# Altium project CanTho.PrjPCB
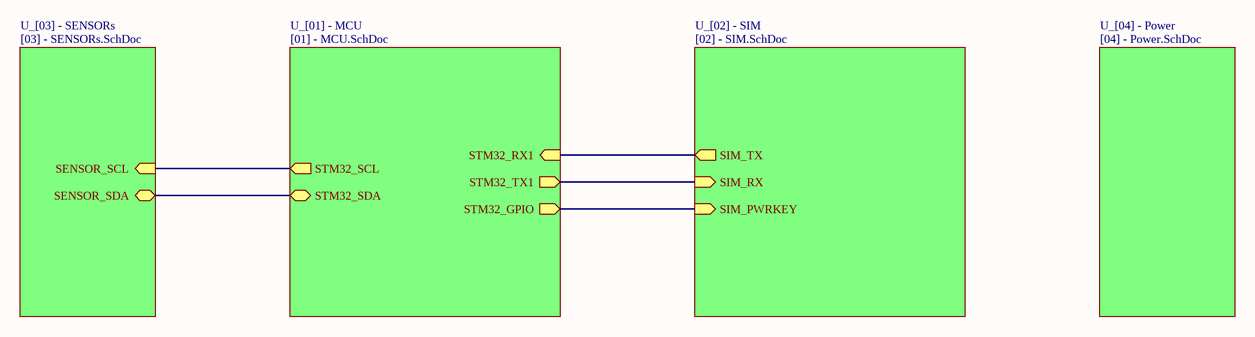
[diagram p0: Sheet_Connector.SchDoc]
5 sheets, 60 parts. Net scope: hierarchical (ports join the sheet entries above them; power ports are global).
Board file: CanTho.PcbDoc
Sheets:
  Sheet_Connector.SchDoc
    U_[01] - MCU = [01] - MCU.SchDoc
    U_[02] - SIM = [02] - SIM.SchDoc
    U_[03] - SENSORs = [03] - SENSORs.SchDoc
    U_[04] - Power = [04] - Power.SchDoc

## Sheet Sheet_Connector.SchDoc: =ProjectName
size A4; CheckedBy: DatNB; Author: Ven; CompanyName: Nacentech; Organization: IMET

### Sub-sheets
U_[01] - MCU = [01] - MCU.SchDoc: STM32_TX1 (out), STM32_RX1 (in), STM32_SCL (out), STM32_SDA (bidir), STM32_GPIO (out)
U_[02] - SIM = [02] - SIM.SchDoc: SIM_TX (out), SIM_RX (in), SIM_PWRKEY (in)
U_[03] - SENSORs = [03] - SENSORs.SchDoc: SENSOR_SCL (in), SENSOR_SDA (bidir)
U_[04] - Power = [04] - Power.SchDoc: no entries

### Nets
RX1: sheet U_[01] - MCU/STM32_RX1, sheet U_[02] - SIM/SIM_TX
TX1: sheet U_[01] - MCU/STM32_TX1, sheet U_[02] - SIM/SIM_RX
NetJ2_3: sheet U_[01] - MCU/STM32_SCL, sheet U_[03] - SENSORs/SENSOR_SCL
NetJ2_4: sheet U_[01] - MCU/STM32_SDA, sheet U_[03] - SENSORs/SENSOR_SDA
NetR11_1: sheet U_[01] - MCU/STM32_GPIO, sheet U_[02] - SIM/SIM_PWRKEY

### Notes on the sheet
- Project:
- Page Contents:
- Size:
- Date:
- A4
- Checked by:
- Time:
- Revision:
- Sheet
- of
- File:

## Sheet [01] - MCU.SchDoc: =ProjectName
size A4; CheckedBy: DatNB; Author: Ven; CompanyName: Nacentech; Organization: IMET
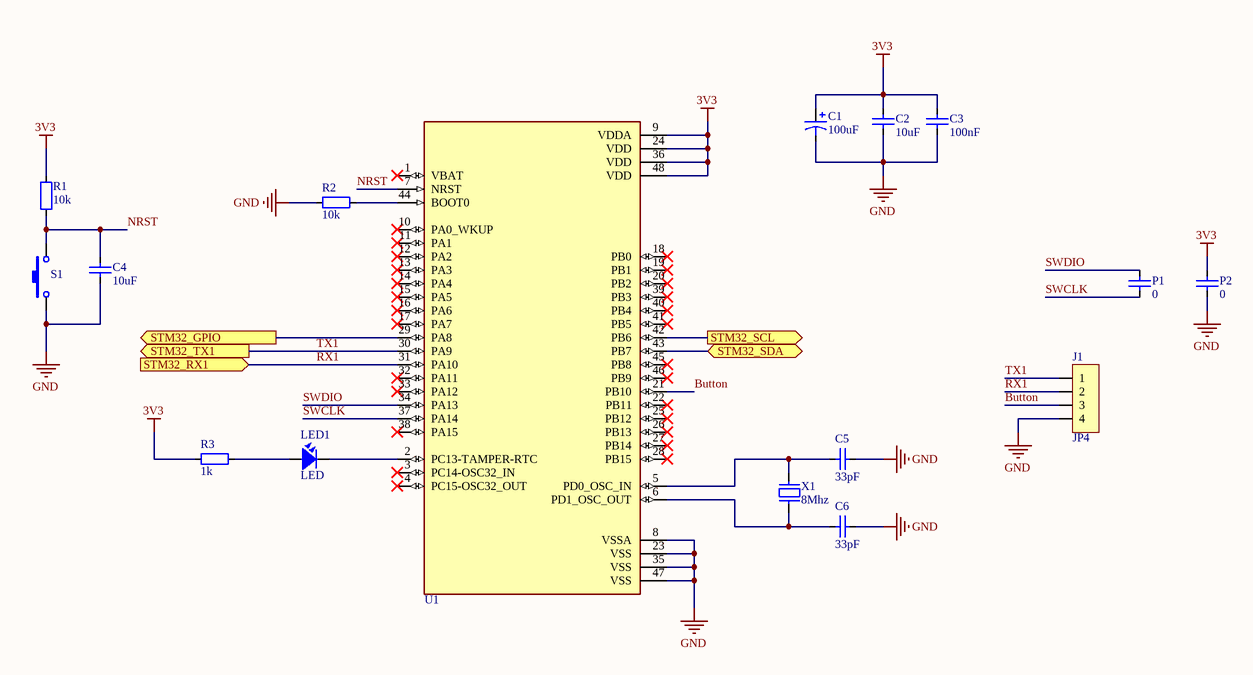
[diagram p1: [01] - MCU.SchDoc]

### Parts
C1  100uF  [CAP_7343]
C2  10uF  [CAP_0603]
C3  100nF  [CAP_0603]
C4  10uF  [CAP_0603]
C5  33pF  [CAP_0603]
C6  33pF  [CAP_0603]
J1  JP4  [JP4-C1T]
LED1  LED  [LED-0805-Orange]
P1  0  [CAP_0805]
P2  0  [CAP_0805]
R1  10k  [RES-SMD-0603]
R2  10k  [RES-SMD-0603]
R3  1k  [RES-SMD-0603]
S1  SW-SMD  [SW 3x2x4]  (value not drawn)
U1  STM32  [LQFP 48]  (value not drawn)
X1  8Mhz  [XTAL 5032 SMD]

### Ports
STM32_GPIO (out), STM32_RX1 (in), STM32_SCL (out), STM32_SDA (bidir), STM32_TX1 (out)

### Nets
3V3: C1.1 C2.2 C3.2 P2.2 R1.2 R3.1 U1.9(VDDA) U1.24(VDD) U1.36(VDD) U1.48(VDD)
GND: C1.2 C2.1 C3.1 C4.1 C5.2 C6.2 J1.4 P2.1 R2.1 S1.1 U1.8(VSSA) U1.23(VSS) U1.35(VSS) U1.47(VSS)
Button: J1.3 U1.21(PB10)
NRST: C4.2 R1.1 S1.2 U1.7(NRST)
RX1: J1.2 U1.31(PA10) ; port STM32_RX1
SWCLK: P1.1 U1.37(PA14)
SWDIO: P1.2 U1.34(PA13)
TX1: J1.1 U1.30(PA9) ; port STM32_TX1
NetC5_1: C5.1 U1.5(PD0_OSC_IN) X1.2
NetC6_1: C6.1 U1.6(PD1_OSC_OUT) X1.1
NetJ2_3: U1.42(PB6) ; port STM32_SCL
NetJ2_4: U1.43(PB7) ; port STM32_SDA
NetLED1_1: LED1.1 R3.2
NetLED1_2: LED1.2 U1.2(PC13-TAMPER-RTC)
NetR2_2: R2.2 U1.44(BOOT0)
NetR11_1: U1.29(PA8) ; port STM32_GPIO

Not connected (* = marked no-connect by the designer): U1 1(VBAT)* 3(PC14-OSC32_IN)* 4(PC15-OSC32_OUT)* 10(PA0_WKUP)* 11(PA1)* 12(PA2)* 13(PA3)* 14(PA4)* 15(PA5)* 16(PA6)* 17(PA7)* 18(PB0)* 19(PB1)* 20(PB2)* 22(PB11)* 25(PB12)* 26(PB13)* 27(PB14)* 28(PB15)* 32(PA11)* 33(PA12)* 38(PA15)* 39(PB3)* 40(PB4)* 41(PB5)* 45(PB8)* 46(PB9)*

### Notes on the sheet
- Project:
- Page Contents:
- Size:
- Date:
- A4
- Checked by:
- Time:
- Revision:
- Sheet
- of
- File:

### Library data of the parts
C1 = Cap Pol: Tantalum; Published: 8-Jun-2000; LatestRevisionDate: 17-Jul-2002; LatestRevisionNote: Re-released for DXP Platform.; PackageReference: POLAR0.8; Publisher: Altium Limited
C2-C6 = CapSMD: Capacitor; Value: 33p; Published: 8-Jun-2000; LatestRevisionDate: 17-Jul-2002; LatestRevisionNote: Re-released for DXP Platform.; PackageReference: RAD-0.3; Publisher: Altium Limited
J1 = JP4: WR-PHD 2.54 mm Angled Socket Header; Manufacturer: W¨¹rth Elektronik eiSos GmbH; partNo: 613004143121; ComponentLink1 Description: Manufacturer; ComponentLink2 Description: Datasheet; NoPins: 04; Created Date: 29 March 2013; ComponentLink1URL: http://www.we-online.com; ComponentLink2URL: http://katalog.we-online.de/em/datasheet/6130xx143121.pdf; Created by: Karrer Zheng
LED1 = LED: LED Single colour Green and Red; Value: LED 3 ly Single Colour
P1 P2 = CapSMD: Pad; Value: 33p; Published: 8-Jun-2000; LatestRevisionDate: 17-Jul-2002; LatestRevisionNote: Re-released for DXP Platform.; PackageReference: RAD-0.3; Publisher: Altium Limited
R1-R3 = Resistor - SMD: Resistor; Manufacturer: Generic Components; Class: Passive; Published: 08/06/2000; Publisher: Altium Hobart Technology Centre
S1 = SW-SMD: Switch; Published: 24-Mar-1999; LatestRevisionDate: 17-Jul-2002; LatestRevisionNote: Re-released for DXP Platform.; PackageReference: SPST-2; Publisher: Altium Limited
U1 = STM32F103C8T6: STM32 ARM-based 32-bit MCU with 64 Kbytes Flash, 64-pin LQFP, Industrial Temperature
X1 = XT2: Crystal For all Crystal 2pin.; Value: 4Mhz

## Sheet [02] - SIM.SchDoc: =ProjectName
size A4; CheckedBy: DatNB; Author: Ven; CompanyName: Nacentech; Organization: IMET
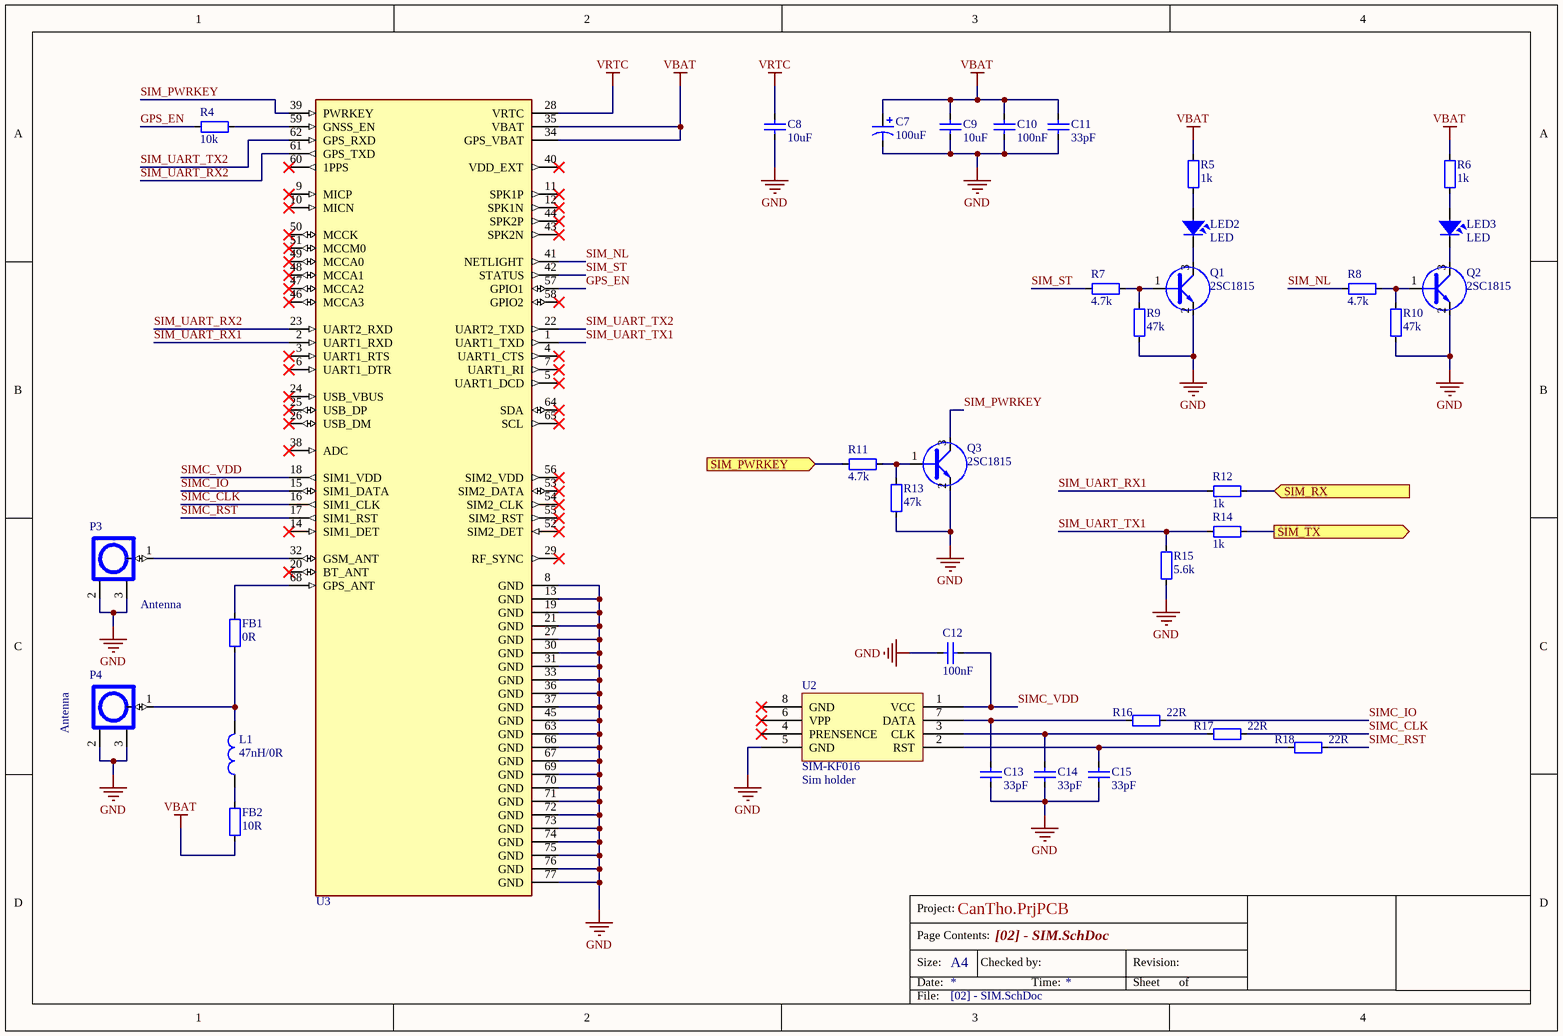
[diagram p2: [02] - SIM.SchDoc]

### Parts
C7  100uF  [CAP_7343]
C8  10uF  [CAP_0603]
C9  10uF  [CAP_0603]
C10  100nF  [CAP_0603]
C11  33pF  [CAP_0603]
C12  100nF  [CAP_0603]
C13  33pF  [CAP_0603]
C14  33pF  [CAP_0603]
C15  33pF  [CAP_0603]
FB1  0R  [RES-SMD-0805]
FB2  10R  [RES-SMD-0805]
L1  47nH/0R  [L-0805]
LED2  LED  [LED-0805-Yellow]
LED3  LED  [LED-1206-Blue]
P3  Antenna  [IPXS]
P4  Antenna  [IPXS]
Q1  2SC1815  [SOT23D]
Q2  2SC1815  [SOT23D]
Q3  2SC1815  [SOT23D]
R4  10k  [RES-SMD-0603]
R5  1k  [RES-SMD-0603]
R6  1k  [RES-SMD-0603]
R7  4.7k  [RES-SMD-0603]
R8  4.7k  [RES-SMD-0603]
R9  47k  [RES-SMD-0603]
R10  47k  [RES-SMD-0603]
R11  4.7k  [RES-SMD-0603]
R12  1k  [RES-SMD-0603]
R13  47k  [RES-SMD-0603]
R14  1k  [RES-SMD-0603]
R15  5.6k  [RES-SMD-0603]
R16  22R  [RES-SMD-0603]
R17  22R  [RES-SMD-0603]
R18  22R  [RES-SMD-0603]
U2  SIM-KF016  value Sim holder  [Sim Socket]
U3  SIM868  [SIM868]  (value not drawn)

### Ports
SIM_PWRKEY (in), SIM_RX (in), SIM_TX (out)

### Nets
GND: C7.2 C8.1 C9.1 C10.1 C11.1 C12.2 C13.1 C14.1 C15.1 P3.2 P3.3 P4.2 P4.3 Q1.2(E) Q2.2(E) Q3.2(E) R9.1 R10.1 R13.1 R15.2 U2.5(GND) U3.8(GND) U3.13(GND) U3.19(GND) U3.21(GND) U3.27(GND) U3.30(GND) U3.31(GND) U3.33(GND) U3.36(GND) U3.37(GND) U3.45(GND) U3.63(GND) U3.66(GND) U3.67(GND) U3.69(GND) U3.70(GND) U3.71(GND) U3.72(GND) U3.73(GND) U3.74(GND) U3.75(GND) U3.76(GND) U3.77(GND)
VBAT: C7.1 C9.2 C10.2 C11.2 FB2.1 R5.2 R6.2 U3.34(GPS_VBAT) U3.35(VBAT)
VRTC: C8.2 U3.28(VRTC)
GPS_EN: R4.1 U3.57(GPIO1)
RX1: R14.1 ; port SIM_TX
SIM_NL: R8.1 U3.41(NETLIGHT)
SIM_PWRKEY: Q3.3(C) U3.39(PWRKEY)
SIM_ST: R7.1 U3.42(STATUS)
SIM_UART_RX1: R12.2 U3.2(UART1_RXD)
SIM_UART_RX2: U3.23(UART2_RXD) U3.61(GPS_TXD)
SIM_UART_TX1: R14.2 R15.1 U3.1(UART1_TXD)
SIM_UART_TX2: U3.22(UART2_TXD) U3.62(GPS_RXD)
SIMC_CLK: R17.1 U3.16(SIM1_CLK)
SIMC_IO: R16.1 U3.15(SIM1_DATA)
SIMC_RST: R18.1 U3.17(SIM1_RST)
SIMC_VDD: C12.1 U2.1(VCC) U3.18(SIM1_VDD)
TX1: R12.1 ; port SIM_RX
NetC13_2: C13.2 R16.2 U2.7(DATA)
NetC14_2: C14.2 R17.2 U2.3(CLK)
NetC15_2: C15.2 R18.2 U2.2(RST)
NetFB1_1: FB1.1 L1.2 P4.1
NetFB1_2: FB1.2 U3.68(GPS_ANT)
NetFB2_2: FB2.2 L1.1
NetLED2_1: LED2.1 R5.1
NetLED2_2: LED2.2 Q1.3(C)
NetLED3_1: LED3.1 R6.1
NetLED3_2: LED3.2 Q2.3(C)
NetP3_1: P3.1 U3.32(GSM_ANT)
NetQ1_1: Q1.1(B) R7.2 R9.2
NetQ2_1: Q2.1(B) R8.2 R10.2
NetQ3_1: Q3.1(B) R11.2 R13.2
NetR4_2: R4.2 U3.59(GNSS_EN)
NetR11_1: R11.1 ; port SIM_PWRKEY

Not connected (* = marked no-connect by the designer): U2 4(PRENSENCE)* 6(VPP)* 8(GND)*; U3 3(UART1_RTS)* 4(UART1_CTS)* 5(UART1_DCD)* 6(UART1_DTR)* 7(UART1_RI)* 9(MICP)* 10(MICN)* 11(SPK1P)* 12(SPK1N)* 14(SIM1_DET)* 20(BT_ANT)* 24(USB_VBUS)* 25(USB_DP)* 26(USB_DM)* 29(RF_SYNC)* 38(ADC)* 40(VDD_EXT)* 43(SPK2N)* 44(SPK2P)* 46(MCCA3)* 47(MCCA2)* 48(MCCA1)* 49(MCCA0)* 50(MCCK)* 51(MCCM0)* 52(SIM2_DET)* 53(SIM2_DATA)* 54(SIM2_CLK)* 55(SIM2_RST)* 56(SIM2_VDD)* 58(GPIO2)* 60(1PPS)* 64(SDA)* 65(SCL)*

### Notes on the sheet
- Project:
- Page Contents:
- Size:
- Date:
- A4
- Checked by:
- Time:
- Revision:
- Sheet
- of
- File:

### Library data of the parts
C7 = Cap Pol: Tantalum; Published: 8-Jun-2000; LatestRevisionDate: 17-Jul-2002; LatestRevisionNote: Re-released for DXP Platform.; PackageReference: POLAR0.8; Publisher: Altium Limited
C8-C15 = CapSMD: Capacitor; Value: 33p; Published: 8-Jun-2000; LatestRevisionDate: 17-Jul-2002; LatestRevisionNote: Re-released for DXP Platform.; PackageReference: RAD-0.3; Publisher: Altium Limited
FB1 FB2 = Resistor - SMD: Ferrit Bead; Manufacturer: Generic Components; Class: Passive; Published: 08/06/2000; Publisher: Altium Hobart Technology Centre
L1 = Inductor: Value: 150 mH
LED2 LED3 = LED: as LED1 on sheet [01] - MCU
P3 P4 = IPXSx66: Antenna GSM GPS
Q1-Q3 = 2SC1815: NPN 600mW, ECB; Value: C1815
R4-R18 = Resistor - SMD: as R1 on sheet [01] - MCU; Published: 08/06/2000; Publisher: Altium Hobart Technology Centre
U2 = Sim holder: SIM Card Holder KF-016
U3 = SIM868: SIM868 SIMCOM

## Sheet [03] - SENSORs.SchDoc: =ProjectName
size A4; CheckedBy: DatNB; Author: Ven; CompanyName: Nacentech; Organization: IMET
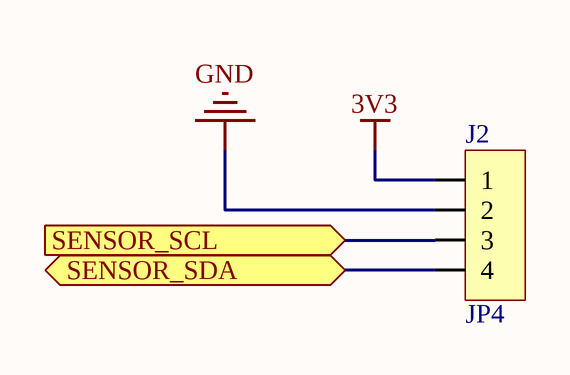
[diagram p3: [03] - SENSORs.SchDoc]

### Parts
J2  JP4  [JP4-C1T]

### Ports
SENSOR_SCL (in), SENSOR_SDA (bidir)

### Nets
3V3: J2.1
GND: J2.2
NetJ2_3: J2.3 ; port SENSOR_SCL
NetJ2_4: J2.4 ; port SENSOR_SDA

### Notes on the sheet
- Project:
- Page Contents:
- Size:
- Date:
- A4
- Checked by:
- Time:
- Revision:
- Sheet
- of
- File:

### Library data of the parts
J2 = JP4: as J1 on sheet [01] - MCU; Created Date: 29 March 2013; ComponentLink1URL: http://www.we-online.com; ComponentLink2URL: http://katalog.we-online.de/em/datasheet/6130xx143121.pdf; Created by: Karrer Zheng

## Sheet [04] - Power.SchDoc: =ProjectName
size A4; CheckedBy: DatNB; Author: Ven; CompanyName: Nacentech; Organization: IMET
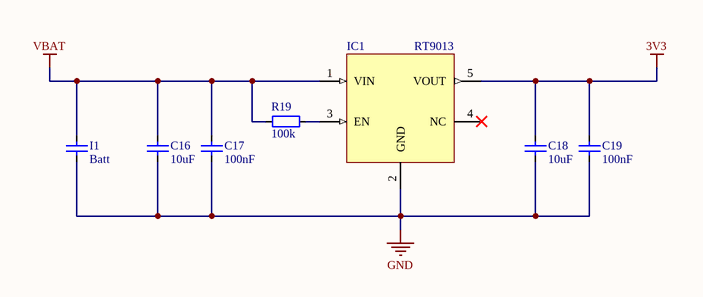
[diagram p4: [04] - Power.SchDoc]

### Parts
C16  10uF  [CAP_0603]
C17  100nF  [CAP_0603]
C18  10uF  [CAP_0603]
C19  100nF  [CAP_0603]
I1  Batt  [CAP_3216]
IC1  RT9013  [SOT23-5]
R19  100k  [RES-SMD-0603]

### Nets
3V3: C18.2 C19.2 IC1.5(VOUT)
GND: C16.1 C17.1 C18.1 C19.1 I1.1 IC1.2(GND)
VBAT: C16.2 C17.2 I1.2 IC1.1(VIN) R19.2
NetIC1_3: IC1.3(EN) R19.1

Not connected (* = marked no-connect by the designer): IC1 4(NC)*

### Notes on the sheet
- Project:
- Page Contents:
- Size:
- Date:
- A4
- Checked by:
- Time:
- Revision:
- Sheet
- of
- File:

### Library data of the parts
C16-C19 = CapSMD: Capacitor; Value: 33p; Published: 8-Jun-2000; LatestRevisionDate: 17-Jul-2002; LatestRevisionNote: Re-released for DXP Platform.; PackageReference: RAD-0.3; Publisher: Altium Limited
I1 = CapSMD: Pad; Value: 33p; Published: 8-Jun-2000; LatestRevisionDate: 17-Jul-2002; LatestRevisionNote: Re-released for DXP Platform.; PackageReference: RAD-0.3; Publisher: Altium Limited
IC1 = RT9013: RT9013-33GB IC REG LINEAR 3.3V 500mA SOT23-5
R19 = Resistor - SMD: as R1 on sheet [01] - MCU; Published: 08/06/2000; Publisher: Altium Hobart Technology Centre

## Nets that join several sheets
3V3: [01] - MCU (10 pins), [03] - SENSORs (J2.1), [04] - Power (C18.2 C19.2 IC1.5)
GND: [01] - MCU (14 pins), [02] - SIM (44 pins), [03] - SENSORs (J2.2), [04] - Power (6 pins)
VBAT: [02] - SIM (9 pins), [04] - Power (5 pins)
NetJ2_3: [01] - MCU (U1.42), [03] - SENSORs (J2.3)
NetJ2_4: [01] - MCU (U1.43), [03] - SENSORs (J2.4)
NetR11_1: [01] - MCU (U1.29), [02] - SIM (R11.1)
RX1: [01] - MCU (J1.2 U1.31), [02] - SIM (R14.1)
TX1: [01] - MCU (J1.1 U1.30), [02] - SIM (R12.1)